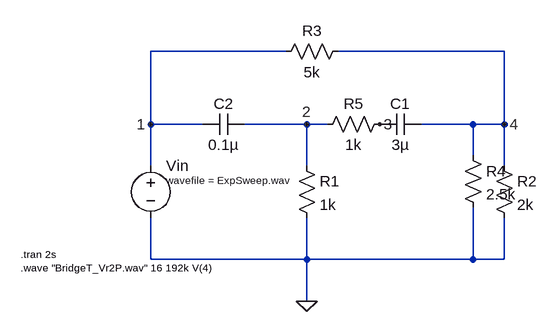
[diagram p0: schematic BridgeTSP.asc]
BridgeTSP.asc, the LTspice schematic file:
Version 4
SHEET 1 880 680
WIRE 256 80 48 80
WIRE 592 80 336 80
WIRE 48 192 48 80
WIRE 128 192 48 192
WIRE 288 192 192 192
WIRE 320 192 288 192
WIRE 544 192 464 192
WIRE 592 192 592 80
WIRE 592 192 544 192
WIRE 544 240 544 192
WIRE 48 256 48 192
WIRE 288 256 288 192
WIRE 592 256 592 192
WIRE 48 400 48 336
WIRE 288 400 288 336
WIRE 288 400 48 400
WIRE 544 400 544 320
WIRE 544 400 288 400
WIRE 592 400 592 336
WIRE 592 400 544 400
WIRE 288 464 288 400
FLAG 288 464 0
FLAG 48 192 1
FLAG 288 192 2
FLAG 400 192 3
FLAG 592 192 4
SYMBOL cap 400 208 R270
WINDOW 0 32 32 VTop 2
WINDOW 3 0 32 VBottom 2
SYMATTR InstName C1
SYMATTR Value 3µ
SYMBOL cap 128 208 R270
WINDOW 0 32 32 VTop 2
WINDOW 3 0 32 VBottom 2
SYMATTR InstName C2
SYMATTR Value 0.1µ
SYMBOL res 272 240 R0
SYMATTR InstName R1
SYMATTR Value 1k
SYMBOL res 576 240 R0
SYMATTR InstName R2
SYMATTR Value 2k
SYMBOL res 240 96 R270
WINDOW 0 32 56 VTop 2
WINDOW 3 0 56 VBottom 2
SYMATTR InstName R3
SYMATTR Value 5k
SYMBOL voltage 48 240 R0
WINDOW 3 24 38 Left 1
SYMATTR Value wavefile = ExpSweep.wav
SYMATTR InstName Vin
SYMBOL res 528 224 R0
SYMATTR InstName R4
SYMATTR Value 2.5k
SYMBOL res 416 176 R90
WINDOW 0 0 56 VBottom 2
WINDOW 3 32 56 VTop 2
SYMATTR InstName R5
SYMATTR Value 1k
TEXT -152 392 Left 1 !.tran 2s\n.wave "BridgeT_Vr2P.wav" 16 192k V(4)

The netlist it stands for:
* BridgeTSP.asc
C1 3 4 3µ
C2 1 2 0.1µ
R1 2 0 1k
R2 4 0 2k
R3 1 4 5k
Vin 1 0 wavefile = ExpSweep.wav
R4 4 0 2.5k
R5 3 2 1k
.tran 2s
.wave "BridgeT_Vr2P.wav" 16 192k V(4)
.backanno
.end